# EAGLE design fauxmo-smd (EAGLE 8.5.0)
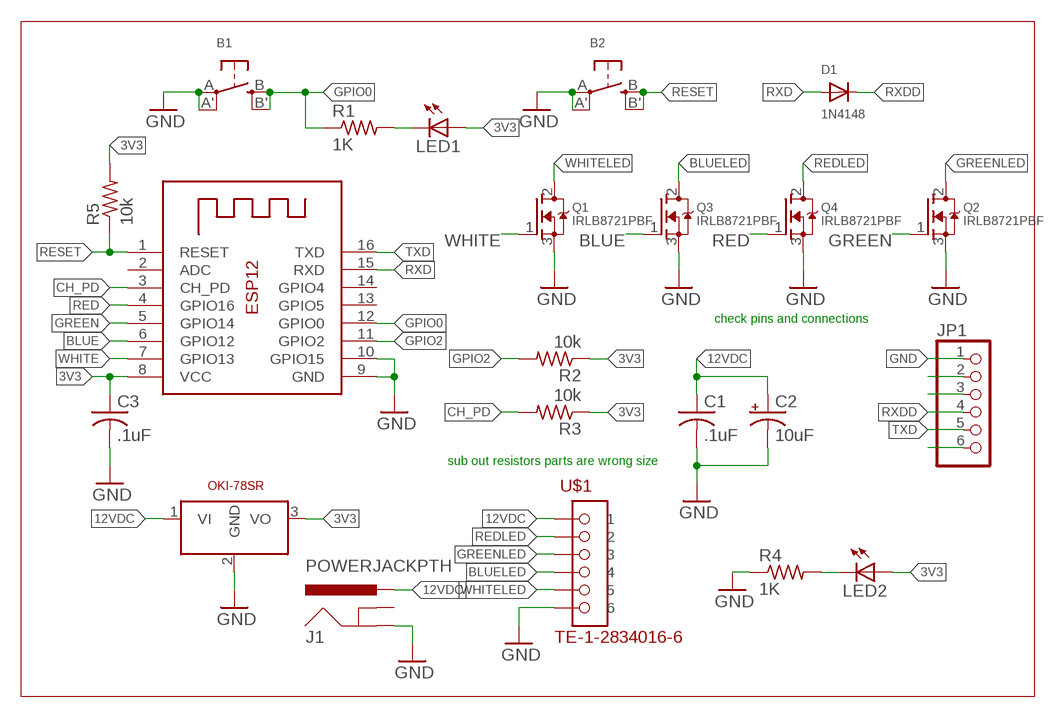
[diagram p0: schematic, sheet 1]

## Parts
B1  SWITCH_TACT_SMT  [EVQ-Q2]
B2  SWITCH_TACT_SMT  [EVQ-Q2]
C1  .1uF  C-USC0805  [C0805]
C2  10uF  CPOL-USE2.5-5  [E2,5-5]
C3  .1uF  C-USC0805  [C0805]
D1  1N4148  DIODESOD-123  [SOD-123]
J1  POWERJACKPTH  [BARREL-2.1]
JP1  PINHD-1X6  [1X06]
LED1  LEDCHIP-LED0805  [CHIP-LED0805]
LED2  LEDCHIP-LED0805  [CHIP-LED0805]
OKI  DCDC_OKI-78SROKI-78SRV  [OKI-78SRH]
Q1  IRLB8721PBF  MOSFET-NGDS_TO220V  [TO220V]
Q2  IRLB8721PBF  MOSFET-NGDS_TO220V  [TO220V]
Q3  IRLB8721PBF  MOSFET-NGDS_TO220V  [TO220V]
Q4  IRLB8721PBF  MOSFET-NGDS_TO220V  [TO220V]
R1  1K  R-US_R0805  [R0805]
R2  10k  R-US_R0805  [R0805]
R3  10k  R-US_R0805  [R0805]
R4  1K  R-US_R0805  [R0805]
R5  10k  R-US_R0805  [R0805]
U$1  TE-1-2834016-6  [TE-1-2834016-6]
X1  ESP-12  [ESP-12]

## Nets
3V3: C3.1 LED1.A LED2.A OKI.3(VO) R2.1 R3.1 R5.2 X1.8(VCC)
12VDC: C1.1 C2.+ J1.PWR OKI.1(VI) U$1.P$6
BLUE: Q3.1(G) X1.6(GPIO12)
BLUELED: Q3.2(D) U$1.P$3
CH_PD: R3.2 X1.3(CH_PD)
GND: B1.A'(P1) B1.A(P) B2.A'(P1) B2.A(P) C1.2 C2.- C3.2 J1.GND JP1.1 OKI.2(GND) Q1.3(S) Q2.3(S) Q3.3(S) Q4.3(S) R4.1 U$1.P$1 X1.9(GND) X1.10(GPIO15)
GPIO0: B1.B'(S1) B1.B(S) R1.1 X1.12(GPIO0)
GPIO2: R2.2 X1.11(GPIO2)
GREEN: Q2.1(G) X1.5(GPIO14)
GREENLED: Q2.2(D) U$1.P$4
N$1: LED1.C R1.2
N$2: JP1.2
N$3: JP1.3
N$4: LED2.C R4.2
N$6: JP1.6
RED: Q4.1(G) X1.4(GPIO16)
REDLED: Q4.2(D) U$1.P$5
RESET: B2.B'(S1) B2.B(S) R5.1 X1.1(RESET)
RXD: D1.A X1.15(RXD)
RXDD: D1.C JP1.4
TXD: JP1.5 X1.16(TXD)
WHITE: Q1.1(G) X1.7(GPIO13)
WHITELED: Q1.2(D) U$1.P$2
Unconnected: J1.GNDBREAK X1.2(ADC) X1.13(GPIO5) X1.14(GPIO4)

## Notes on the sheet
- check pins and connections
- sub out resistors parts are wrong size
- OKI-78SR

## Library data of the parts
B1 B2 = microbuilder:SWITCH_TACT_SMT: SMT Tact Switches 6x6mm - Digikey: P12940SCT-ND KMR2 (4.6x2.8mm) - Digikey: 401-1426-1-ND EVQ-PQHB55 - Light Touch, 160GF (4.5x4.5mm) - Digikey: P8090SCT-ND
C1 C3 = adafruit:C-US: CAPACITOR, American symbol
C2 = adafruit:CPOL-US: POLARIZED CAPACITOR, American symbol
D1 = adafruit:DIODE: Diode SMADIODE - SMA Surface Mount Package 20V 1A Schottky Diode Digikey: 641-1014-6-ND DO-1N4148 - Through Hole Small Current Diode SOD-123 20V 1 A (.5mV Vf) Schottky Diode - Digikey: MBRX120TPMSCT-ND SOD-323 10V 570mA (.38mV Vf, 3ns) Schottky Diode - Digikey: ZLLS410CT-ND SOD-523 30V 30mA Schottky Diode (RB751S-40TE61) - Digikey: RB751S-40TE61CT-ND SOT23-R/W - SOT23 Package (R = Solder Paste/Reflow Ovens, W = Hand-Soldering) BAT54Film 40V 300mA - Digikey: 497-7162-1-ND
J1 = Bryan:POWERJACK
JP1 = pinhead:PINHD-1X6: PIN HEADER
LED1 LED2 = adafruit:LED: LED OSRAM: - CHIPLED LG R971, LG N971, LY N971, LG Q971, LY Q971, LO R971, LY R971 LH N974, LH R974 LS Q976, LO Q976, LY Q976 LO Q996 - Hyper CHIPLED LW Q18S LB Q993, LB Q99A, LB R99A - SideLED LS A670, LO A670, LY A670, LG A670, LP A670 LB A673, LV A673, LT A673, LW A673 LH A674 LY A675 LS A676, LA A676, LO A676, LY A676, LW A676 LS A679, LY A679, LG A679 - Hyper Micro SIDELED® LS Y876, LA Y876, LO Y876, LY Y876 LT Y87S - SmartLED LW L88C, LW L88S LB L89C, LB L89S, LG L890 LS L89K, LO L89K, LY L89K LS L896, LA L896, LO L896, LY L896 - TOPLED LS T670, LO T670, LY T670, LG T670, LP T670 LSG T670, LSP T670, LSY T670, LOP T670, LYG T670 LG T671, LOG T671, LSG T671 LB T673, LV T673, LT T673, LW T673 LH T674 LS T676, LA T676, LO T676, LY T676, LB T676, LH T676, LSB T676, LW T676 LB T67C, LV T67C, LT T67C, LS T67K, LO T67K, LY T67K, LW E67C LS E67B, LA E67B, LO E67B, LY E67B, LB E67C, LV E67C, LT E67C LW T67C LS T679, LY T679, LG T679 LS T770, LO T770, LY T770, LG T770, LP T770 LB T773, LV T773, LT T773, LW T773 LH T774 LS E675, LA E675, LY E675, LS T675 LS T776, LA T776, LO T776, LY T776, LB T776 LHGB T686 LT T68C, LB T68C - Hyper Mini TOPLED® LB M676 - Mini TOPLED Santana® LG M470 LS M47K, LO M47K, LY M47K Source: http://www.osram.convergy.de/
OKI = BrentVoltz:DCDC_OKI-78SR: 4.95W DC/DC Converter Manufacturer: Murata Part Number: OKI-78SR-5/1.5-W36H-C OKI-78SR-3.3/1.5-W36H-C
Q1-Q4 = adafruit:MOSFET-N: N-Channel Mosfet 2N7002E - 60V 260mA SOT23 [Digikey: 2N7002ET1GOSTR-ND] - REEL BSH103 - 30V 850mA SOT23 [Digikey: 568-5013-1-ND]
R1-R5 = adafruit:R-US_: RESISTOR, American symbol
U$1 = BrentVoltz:TE-1-2834016-6
X1 = adafruit:ESP-12

## Board
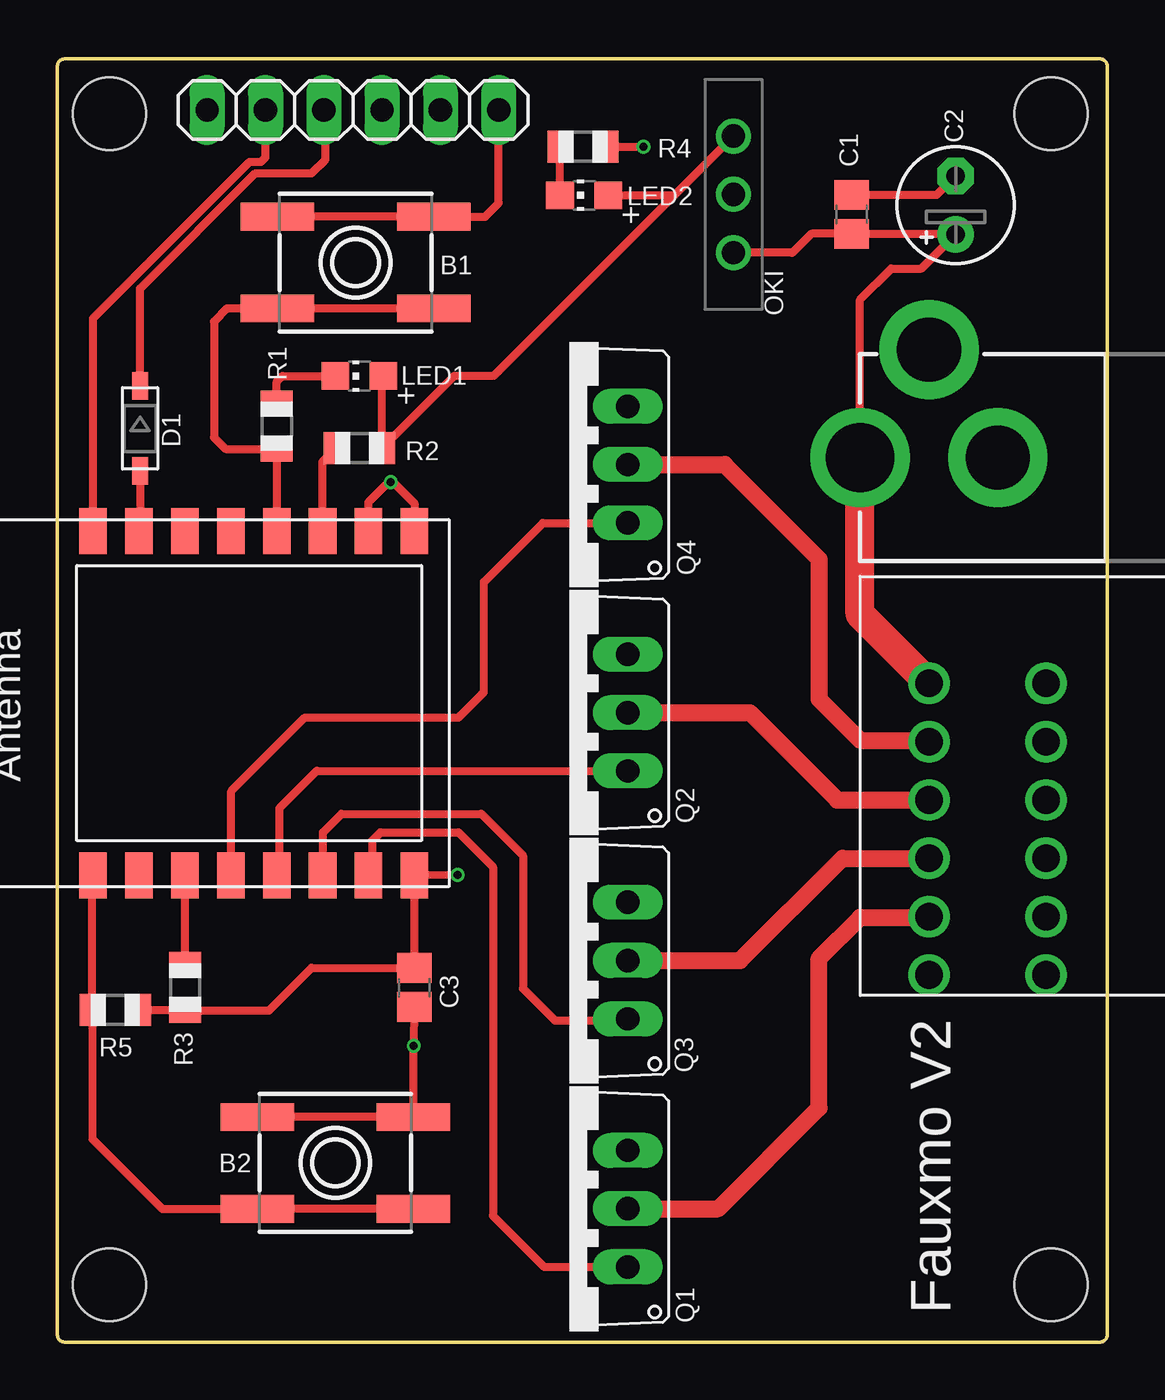
[diagram p1: board, top side]
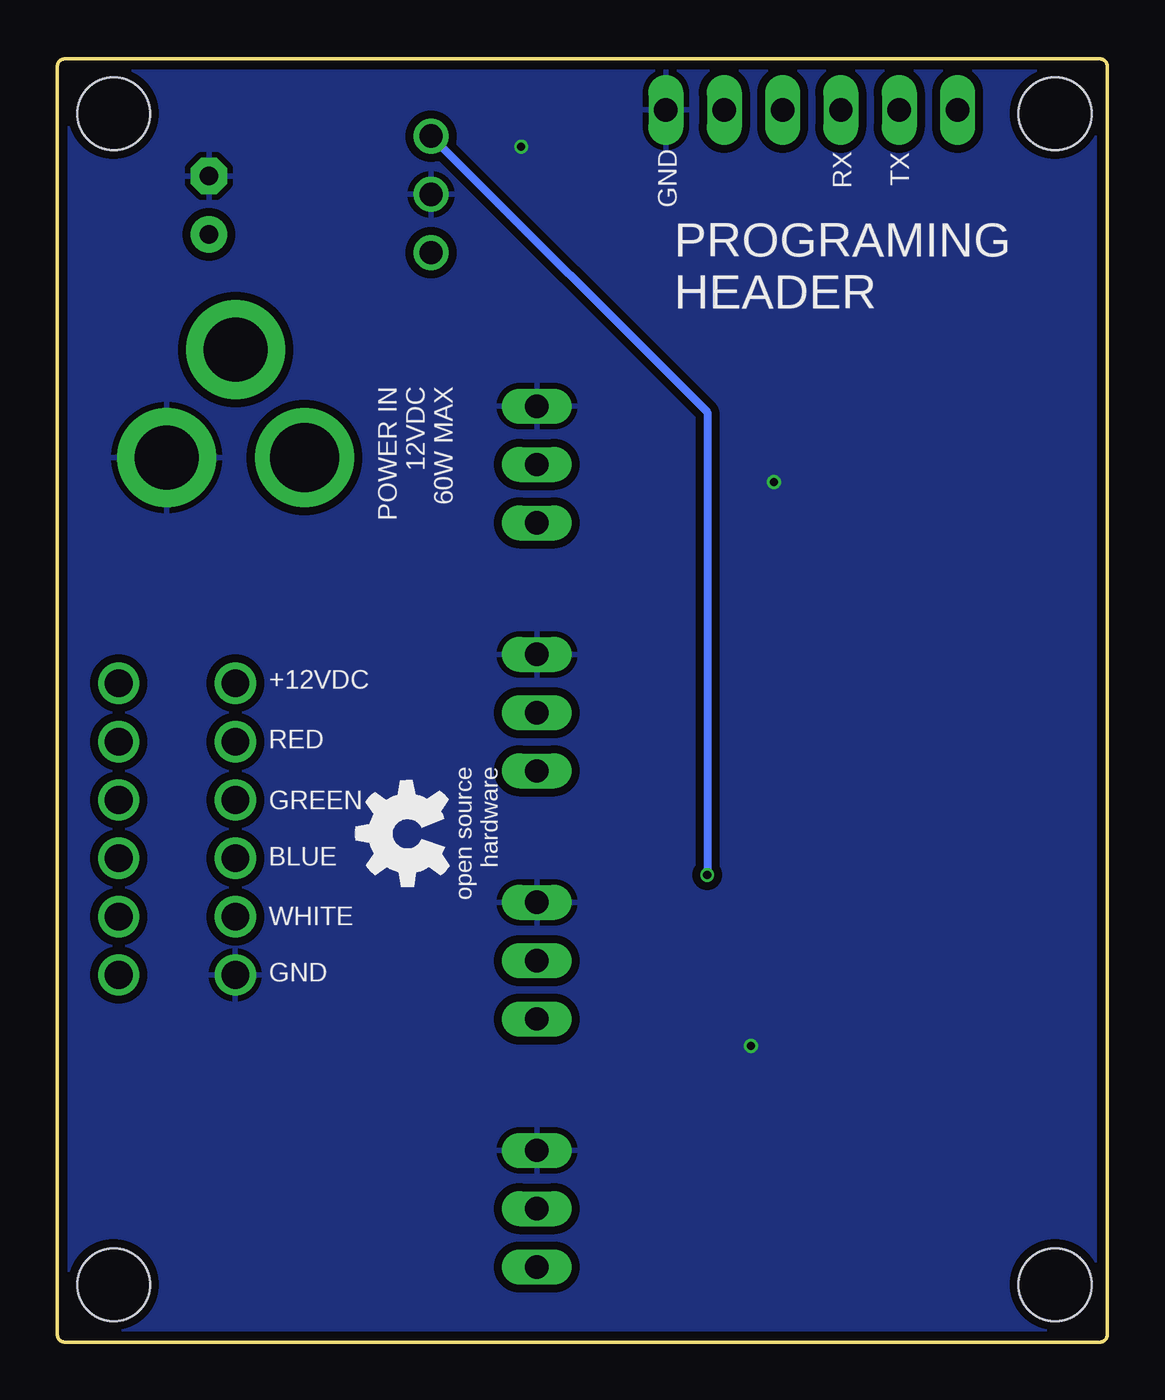
[diagram p2: board, bottom side, seen from below]

Size 45.72 x 55.88 mm. Coordinates in mm from the lower left corner, seen from the top.
Outline: 0,55.56 0,0.32 arc90 0.32,0 45.4,0 arc90 45.72,0.32 45.72,55.56 arc90 45.4,55.88 0.32,55.88 arc90 0,55.56
Copper layers (1*16): Top 0.035559375mm / dielectric 1.6mm / Bottom 0.035559375mm
Design rules "oshpark-2layer": minimum track width 6mil, minimum drill 10mil, track to track 6mil, track to pad 6mil, pad to pad 6mil, via to via 6mil, smd to smd 6mil, copper to edge 15mil, drill to drill 6mil, minimum pad ring 5mil, minimum via ring 5mil, stop-mask expansion 2.5mil, vias tented up to drill 0mil, thermal gap 10mil
Holes 3.17 mm at 2.27,53.5 43.27,53.5 43.27,2.5 2.27,2.5

### Footprints (pad centres in the part's own frame; a part is rotated, then mirrored left to right if it is on the bottom)
EVQ-Q2 = smd 3.2 x 1.2: A -3.4,-2; A' 3.4,-2; B -3.4,2; B' 3.4,2
C0805 = smd 1.3 x 1.5: 1 -0.85,0; 2 0.85,0
E2,5-5 = drill 0.813 pad 1.6: + -1.27,0 | drill 0.813 pad 1.6 octagon: - 1.27,0
SOD-123 = smd 1.2 x 0.7: A 1.85,0; C -1.85,0
BARREL-2.1 = drill 2.8 pad 4.318: GND 0,7.7; GNDBREAK 4.7,10.7 | drill 2.997 pad 4.318: PWR 0,13.7
1X06 = drill 1.016 long: 1 -6.35,0; 2 -3.81,0; 3 -1.27,0; 4 1.27,0; 5 3.81,0; 6 6.35,0
CHIP-LED0805 = smd 1.2 x 1.2: A 0,-1.05; C 0,1.05
OKI-78SRH = drill 1.016: 1 2.54,0; 2 0,0; 3 -2.54,0
TO220V = drill 1.016 long: 1 -2.54,-2.54; 2 0,-2.54; 3 2.54,-2.54
R0805 = smd 1.1 x 1.4: 1 -1,0; 2 1,0
TE-1-2834016-6 = drill 1.2: P$1 0,0; P$2 0,2.54; P$3 0,5.08; P$4 0,7.62; P$5 0,10.16; P$6 0,12.7; P$7 5.08,0; P$8 5.08,2.54; P$9 5.08,5.08; P$10 5.08,7.62; P$11 5.08,10.16; P$12 5.08,12.7
ESP-12 = smd 2 x 1.2: 1 -7.5,4.5; 2 -7.5,2.5; 3 -7.5,0.5; 4 -7.5,-1.5; 5 -7.5,-3.5; 6 -7.5,-5.5; 7 -7.5,-7.5; 8 -7.5,-9.5; 9 7.5,-9.5; 10 7.5,-7.5; 11 7.5,-5.5; 12 7.5,-3.5; 13 7.5,-1.5; 14 7.5,0.5; 15 7.5,2.5; 16 7.5,4.5

### Placement (x,y rotation side)
B1  12.98,47.01 180 top
B2  12.11,7.8 180 top
C1  34.59,49.11 90 top
C2  39.12,49.51 90 top
C3  15.54,15.45 270 top
D1  3.6,39.79 270 top
J1  48.66,38.52 90 top
JP1  12.87,53.66 180 top
LED1  13.15,42.07 90 top
LED2  22.94,49.94 90 top
OKI  29.44,49.98 270 top
Q1  22.3,5.81 90 top
Q2  22.3,27.41 90 top
Q3  22.3,16.61 90 top
Q4  22.3,38.21 90 top
R1  9.55,39.9 90 top
R2  13.15,38.94 180 top
R3  5.56,15.45 90 top
R4  22.89,52.06 180 top
R5  2.52,14.47 0 top
U$1  37.97,15.99 0 top
U$2  [OSHW_5MM]  30.47,22.14 90 bottom
X1  6.05,27.83 90 top

### Tracks (layer width: path | path; a pad name or v marks a point on that pad's centre or on a via)
3V3  (via drill 0.35)
  Top 0.152: C3.1 15.55,16.4 15.45,16.3 | 29.38,52.58 OKI.3
  Top 0.35: 15.55,16.4 X1.8 v17.42,20.35 | 15.45,16.3 11.07,16.3 9.21,14.45 R3.1 5.54,14.47 R5.2 | 26.86,49.94 19,42.07 17.29,42.07 R2.1 14.15,42.02 LED1.A | 26.86,49.94 OKI.3 | LED2.A 26.86,49.94
  Bottom 0.35: OKI.3 17.42,40.49 v17.42,20.35
12VDC
  Top 0.35: J1.PWR 34.96,45.39 36.32,46.75 37.63,46.75 C2.+ 34.61,48.24 C1.1 32.83,48.26 32.01,47.44 OKI.1
  Top 1.27: U$1.P$6 34.96,31.7 J1.PWR
BLUE
  Top 0.152: X1.6 11.57,19.52 | 24.8,14 Q3.1
  Top 0.35: 11.57,19.52 11.57,22.2 12.37,23 18.47,23 20.27,21.2 20.27,15.4 21.67,14 24.8,14
BLUELED
  Top 0.152: 37.94,21.1 U$1.P$3
  Top 0.75: Q3.2 29.73,16.61 34.19,21.07 U$1.P$3
CH_PD
  Top 0.152: 5.56,20.31 X1.3
  Top 0.35: R3.2 5.56,20.31
GND  (via drill 0.35)
  Top 0.35: C3.2 v15.52,12.9 15.5,12.88 B2.A B2.A' | C1.2 38.3,49.96 C2.- | R4.1 v25.51,52.06 v25.52,52.05 | X1.10 13.55,36.58 14.42,37.45 v14.52,37.45 14.62,37.45 15.55,36.52 X1.9 | JP1.1 19.22,49.6 18.63,49.01 B1.A B1.A'
  pour Bottom (isolate 0.35): -0.08,55.95 -0.08,-0.1 45.82,-0.1 45.82,56 -0.08,56
GPIO0
  Top 0.35: X1.12 R1.1 7.32,38.9 6.82,39.4 6.82,44.45 7.38,45.01 B1.B' B1.B
GPIO2
  Top 0.35: X1.11 11.55,38.34 R2.2
GREEN
  Top 0.152: X1.5 9.67,20.45
  Top 0.35: 9.67,20.45 9.67,23.25 11.29,24.87 Q2.1
GREENLED
  Top 0.152: U$1.P$4
  Top 0.75: Q2.2 30.16,27.41 33.97,23.61 U$1.P$4
N$1
  Top 0.35: R1.2 9.55,41.84 9.79,42.07 LED1.C
N$4
  Top 0.35: LED2.C R4.2
RED
  Top 0.152: X1.4 7.57,19.52
  Top 0.35: 7.57,19.52 7.57,24 10.77,27.2 17.47,27.2 18.57,28.3 18.57,33.1 21.14,35.67 Q4.1
REDLED
  Top 0.152: 37.92,26.2 U$1.P$5
  Top 0.75: Q4.2 29.05,38.22 33.17,34.1 33.17,28 34.97,26.2 37.92,26.2
RESET
  Top 0.35: B2.B 9.32,5.8 B2.B' | B2.B' | X1.1 1.52,20.3 R5.1 1.52,8.85 4.57,5.8 B2.B'
RXD
  Top 0.152: X1.15 3.61,35.39
  Top 0.35: D1.A 3.6,35.38 X1.15
RXDD
  Top 0.35: D1.C 3.6,45.88 8.62,50.9 11.07,50.9 11.67,51.5 11.67,53.59 JP1.4
TXD
  Top 0.35: X1.16 1.55,44.59 8.36,51.4 8.87,51.4 9.06,51.59 JP1.5
WHITE
  Top 0.152: 13.55,21.08 X1.7 13.72,20.5
  Top 0.35: 13.72,20.5 13.72,21.85 14.07,22.2 17.47,22.2 18.97,20.7 18.97,5.5 21.2,3.27 Q1.1
WHITELED
  Top 0.152: 37.94,18.5 U$1.P$2
  Top 0.75: Q1.2 28.78,5.81 33.17,10.2 33.17,16.7 34.97,18.5 37.94,18.5

### Text on the board
tPlace: Fauxmo V2
bNames: TX | RX | GND | PROGRAMING / HEADER | POWER IN / 12VDC / 60W MAX | +12VDC | RED | GREEN | BLUE | WHITE | GND